# EAGLE design gen13 (EAGLE 7.2.0)
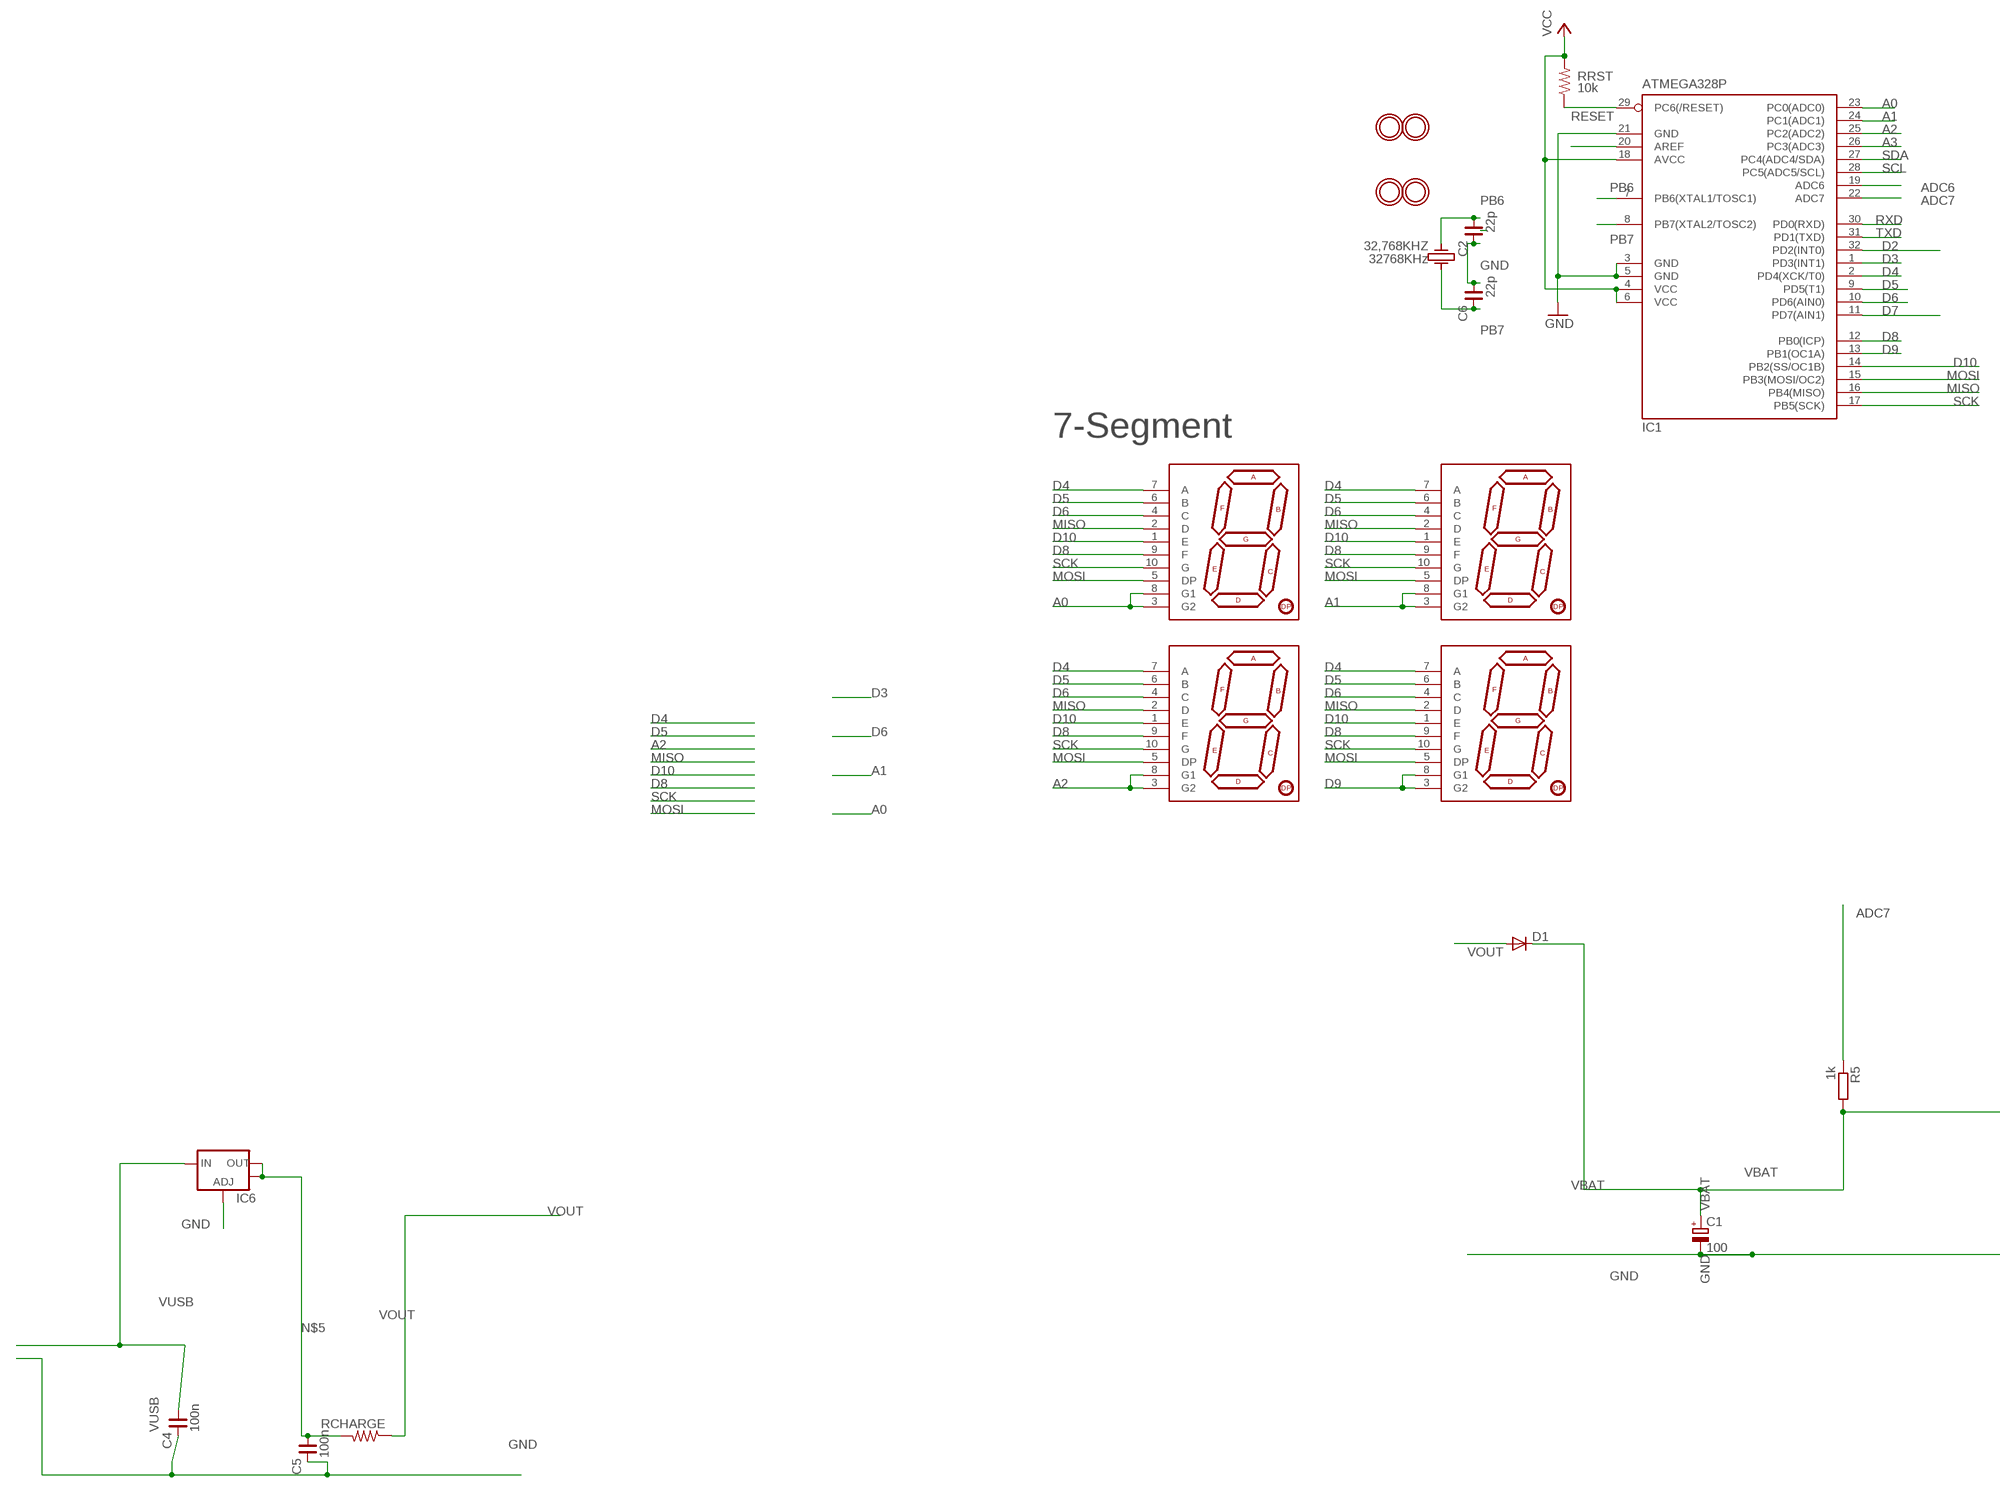
[diagram p0: schematic, sheet 1, part 1 of 2]
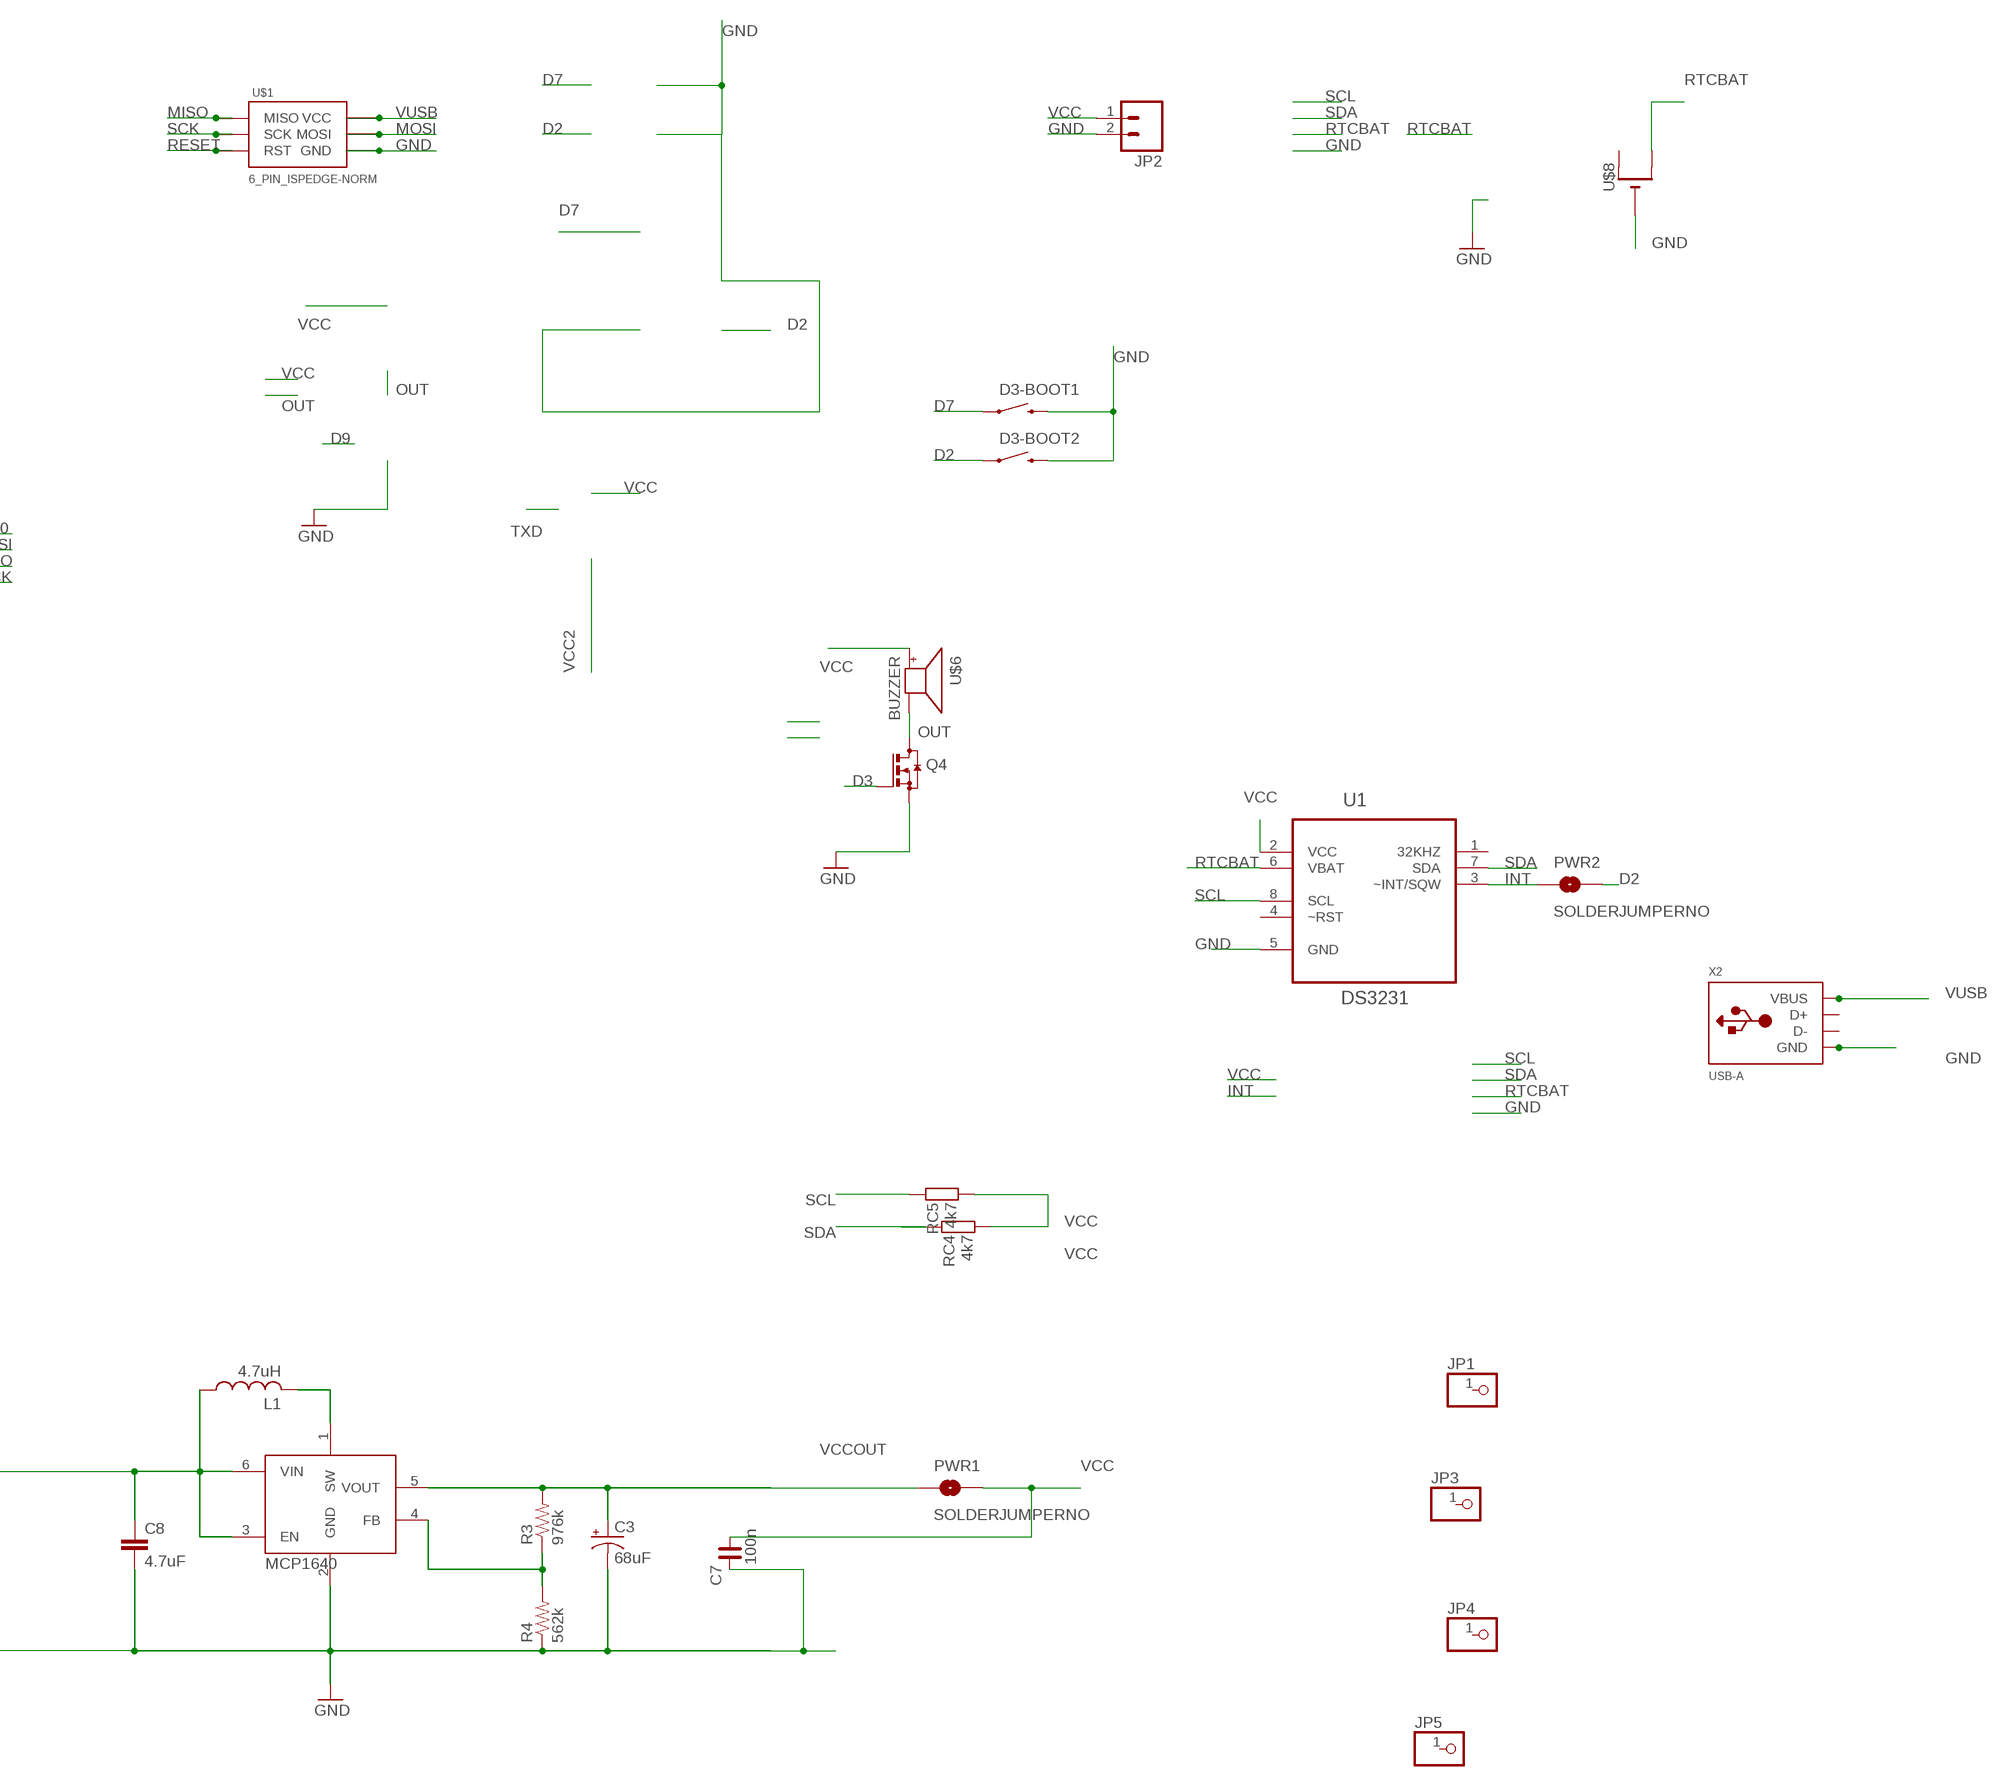
[diagram p1: schematic, sheet 1, part 2 of 2]

## Parts
32,768KHZ  32768KHz  CRYSTALL  [KX-327LT]
C1  100  CPOL-EUTT2D4  [TT2D4]
C2  22p  C_0603  [C0603]
C3  68uF  CAP_POL1206  [EIA3216]
C4  100n  C_0603  [C0603]
C5  100n  C_0603  [C0603]
C6  22p  C_0603  [C0603]
C7  100n  C_0603  [C0603]
C8  4.7uF  CAP0805  [0805]
D1  DIODE-DO214AC  [DO214AC]
D3-BOOT1  SWITCH-MOMENTARY-2-SMD-1101NE  [TACTILE-SWITCH-1101NE]
D3-BOOT2  SWITCH-MOMENTARY-2-SMD-1101NE  [TACTILE-SWITCH-1101NE]
DIG1  7-SEGMENT-DISPLAY-1"-RED  [7-SEGMENT-SMD]
DIG2  7-SEGMENT-DISPLAY-1"-RED  [7-SEGMENT-SMD]
DIG3  7-SEGMENT-DISPLAY-1"-RED  [7-SEGMENT-SMD]
DIG4  7-SEGMENT-DISPLAY-1"-RED  [7-SEGMENT-SMD]
IC1  ATMEGA328P  MEGA8-AI  [TQFP32-08]
IC6  V_REG_LM1117SOT223  [SOT223]
JP1  PINHD-1X1  [1X01]
JP2  M02PTH  [1X02]
JP3  PINHD-1X1  [1X01]
JP4  PINHD-1X1  [1X01]
JP5  PINHD-1X1  [1X01]
L1  4.7uH  LLQH44P_P0  [LQH44]
PWR1  SOLDERJUMPERNO  [SJ_2S-NO]
PWR2  SOLDERJUMPERNO  [SJ_2S-NO]
Q4  BSS123  [SOT23]
R3  976k  RESISTOR0603-RES  [0603-RES]
R4  562k  RESISTOR0603-RES  [0603-RES]
R5  1k  R-EU_R0603  [R0603]
RC4  4k7  R-EU_R0603  [R0603]
RC5  4k7  R-EU_R0603  [R0603]
RCHARGE  RESISTOR1206  [1206]
RRST  10k  R-US_R0603  [R0603@1]
U1  DS3231  DS3231MZ+  [SOIC8_150MIL]
U2  MCP1640  [SOT23-6]
U$1  6_PIN_ISPEDGE-NORM  [6_PIN_EDGE]
U$2  MOUNTINGHOLE2.0  [MOUNTINGHOLE_2.0_PLATED]
U$3  MOUNTINGHOLE2.0  [MOUNTINGHOLE_2.0_PLATED]
U$4  MOUNTINGHOLE2.0  [MOUNTINGHOLE_2.0_PLATED]
U$5  MOUNTINGHOLE2.0  [MOUNTINGHOLE_2.0_PLATED]
U$6  BUZZER  [SMT-8585-BUZZER]
U$8  CR1220SMT  [CR1220-SMD]
X2  USB-A  [MOLEX_480371000]

## Nets
A0: DIG1.3(G2) DIG1.8(G1) IC1.23(PC0(ADC0))
A1: DIG2.3(G2) DIG2.8(G1) IC1.24(PC1(ADC1))
A2: DIG3.3(G2) DIG3.8(G1) IC1.25(PC2(ADC2))
A3: IC1.26(PC3(ADC3))
ADC6: IC1.19(ADC6)
ADC7: IC1.22(ADC7) R5.1
AREF: IC1.20(AREF)
D2: D3-BOOT2.P$1 IC1.32(PD2(INT0)) PWR2.2
D3: IC1.1(PD3(INT1)) Q4.1(G)
D4: DIG1.7(A) DIG2.7(A) DIG3.7(A) DIG4.7(A) IC1.2(PD4(XCK/T0))
D5: DIG1.6(B) DIG2.6(B) DIG3.6(B) DIG4.6(B) IC1.9(PD5(T1))
D6: DIG1.4(C) DIG2.4(C) DIG3.4(C) DIG4.4(C) IC1.10(PD6(AIN0))
D7: D3-BOOT1.P$1 IC1.11(PD7(AIN1))
D8: DIG1.9(F) DIG2.9(F) DIG3.9(F) DIG4.9(F) IC1.12(PB0(ICP))
D9: DIG4.3(G2) DIG4.8(G1) IC1.13(PB1(OC1A))
D10: DIG1.1(E) DIG2.1(E) DIG3.1(E) DIG4.1(E) IC1.14(PB2(SS/OC1B))
GND [pwr]: C1.- C2.2 C3.C(-) C4.2 C5.2 C6.1 C7.2 C8.2 D3-BOOT1.P$2 D3-BOOT2.P$2 IC1.3(GND) IC1.5(GND) IC1.21(GND) IC6.1(ADJ) JP2.2 Q4.2(S) R4.1 U1.5(GND) U2.2(GND) U$1.6(GND) U$8.- X2.4(GND)
INT: PWR2.1 U1.3(~INT/SQW)
MISO: DIG1.2(D) DIG2.2(D) DIG3.2(D) DIG4.2(D) IC1.16(PB4(MISO)) U$1.1(MISO)
MOSI: DIG1.5(DP) DIG2.5(DP) DIG3.5(DP) DIG4.5(DP) IC1.15(PB3(MOSI/OC2)) U$1.4(MOSI)
N$4: L1.P$2 U2.1(SW)
N$5: C5.1 IC6.2(OUT) IC6.4(OUT) RCHARGE.2
N$6: R3.1 R4.2 U2.4(FB)
OUT: Q4.3(D) U$6.-
PB6: 32,768KHZ.4 C2.1 IC1.7(PB6(XTAL1/TOSC1))
PB7: 32,768KHZ.1 C6.2 IC1.8(PB7(XTAL2/TOSC2))
RESET: IC1.29(PC6(/RESET)) RRST.1 U$1.5(RST)
RTCBAT: U1.6(VBAT) U$8.+$2(+1)
RXD: IC1.30(PD0(RXD))
SCK: DIG1.10(G) DIG2.10(G) DIG3.10(G) DIG4.10(G) IC1.17(PB5(SCK)) U$1.3(SCK)
SCL: IC1.28(PC5(ADC5/SCL)) RC5.2 U1.8(SCL)
SDA: IC1.27(PC4(ADC4/SDA)) RC4.2 U1.7(SDA)
TXD: IC1.31(PD1(TXD))
VBAT [pwr]: C1.+ C8.1 D1.C L1.P$1 R5.2 U2.3(EN) U2.6(VIN)
VCC [vcc]: C7.1 IC1.4(VCC) IC1.6(VCC) IC1.18(AVCC) JP2.1 PWR1.2 RC4.1 RC5.1 RRST.2 U1.2(VCC) U$6.+
VCCOUT [vcc]: C3.A(+) PWR1.1 R3.2 U2.5(VOUT)
VOUT [pwr]: D1.A RCHARGE.1
VUSB: C4.1 IC6.3(IN) U$1.2(VCC) X2.1(VBUS)
Unconnected: JP1.1 JP3.1 JP4.1 JP5.1 U1.1(32KHZ) U1.4(~RST) U$8.+$1(+) X2.2(D-) X2.3(D+)

## Notes on the sheet
- 7-Segment

## Library data of the parts
32,768KHZ = es:CRYSTALL
C1 = resistor:CPOL-EU: POLARIZED CAPACITOR, European symbol
C2 C4-C7 = rc-master-smd:C_: NON-POLARIZED CAP
C3 = SparkFun:CAP_POL: Capacitor Polarized These are standard SMD and PTH capacitors. Normally 10uF, 47uF, and 100uF in electrolytic and tantalum varieties. Always verify the external diameter of the through hole cap, it varies with capacity, voltage, and manufacturer. The EIA devices should be standard.
C8 = SparkFun:CAP: Capacitor Standard 0603 ceramic capacitor, and 0.1" leaded capacitor.
D1 = diode:DIODE-: DIODE
D3-BOOT1 D3-BOOT2 = SparkFun:SWITCH-MOMENTARY-2
DIG1-DIG4 = balto:7-SEGMENT-DISPLAY-1"-RED: 7-Segment Display 1" Red (COM-08546)
IC1 = atmel:MEGA8: MICROCONTROLLER 8 Kbytes FLASH, 1 kbytes SRAM, 512 bytes EEPROM, USART, 6-channel 10 bit ADC, 2-channel 8 bit ADC Pin compatible with Atmega48, ATMega88, ATMega168 Source: avr.lbr; MPN: ATMEGA8-16AU; OC_FARNELL: 9171371; OC_NEWARK: 73M8863
IC6 = SparkFun:V_REG_LM1117: Voltage Regulator LM1117 Standard adjustable voltage regulator but in SMD form. Spark Fun Electronics SKU : COM-00595
JP1 JP3-JP5 = pinhead:PINHD-1X1: PIN HEADER
JP2 = SparkFun-Connectors:M02: Standard 2-pin 0.1" header. Use with - straight break away headers ( PRT-00116) - right angle break away headers (PRT-00553) - swiss pins (PRT-00743) - machine pins (PRT-00117) - female headers (PRT-00115) Molex polarized connector foot print use with: PRT-08233 with associated crimp pins and housings. 2.54_SCREWTERM for use with PRT-10571. 3.5mm Screw Terminal footprints for PRT-08084 5mm Screw Terminal footprints for use with PRT-08432
L1 = karlnet-parts:L
PWR1 PWR2 = SparkFun:SOLDERJUMPER: Solder Jumper Standard SMD solder jumper. Used to automate production. Two varients : Normally Open and Normally Closed are the same, but have different paste layers. NC will have a large amount of paste and should jumper during reflow.
Q4 = transistor-small-signal:BSS123: N-CHANNEL MOS FET
R3 R4 RCHARGE = SparkFun:RESISTOR: Resistor Basic schematic elements and footprints for 0603, 1206, and PTH resistors.
R5 RC4 RC5 = rcl:R-EU_: RESISTOR, European symbol
RRST = rcl:R-US_: RESISTOR, American symbol
U1 = zak:DS3231MZ+
U2 = karlnet-parts:MCP1640: MCP1623, 1624, 1640/B/C/D pwm/pfm or pwm only DC/DC converters, in SOT-23
U$1 = ppeter:6_PIN_ISP: AVR 6 PIN ISP header Edge connector normal layout
U$2-U$5 = microbuilder:MOUNTINGHOLE: Mounting Hole
U$6 = adafruit:BUZZER
U$8 = adafruit:CR1220: CR1216/CR1220/CR1225 12mm 3V lithium coin cell Great for battery packup. Both SMT and THM holders. Note the THM package has the ground pads on both sides of the PCB so that the masks are the same - this reduces the cost
X2 = adafruit:USB-A: USB type A 'plug' Used for things that can directly connect to a USB port, say USB key

## Net classes
0 default: width 0.203 mm, drill 0.356 mm, clearance 0.203 mm
1 vcc: width 0.254 mm, drill 0.356 mm, clearance 0.229 mm
2 pwr: width 0.254 mm, drill 0.356 mm, clearance 0.229 mm

## Board
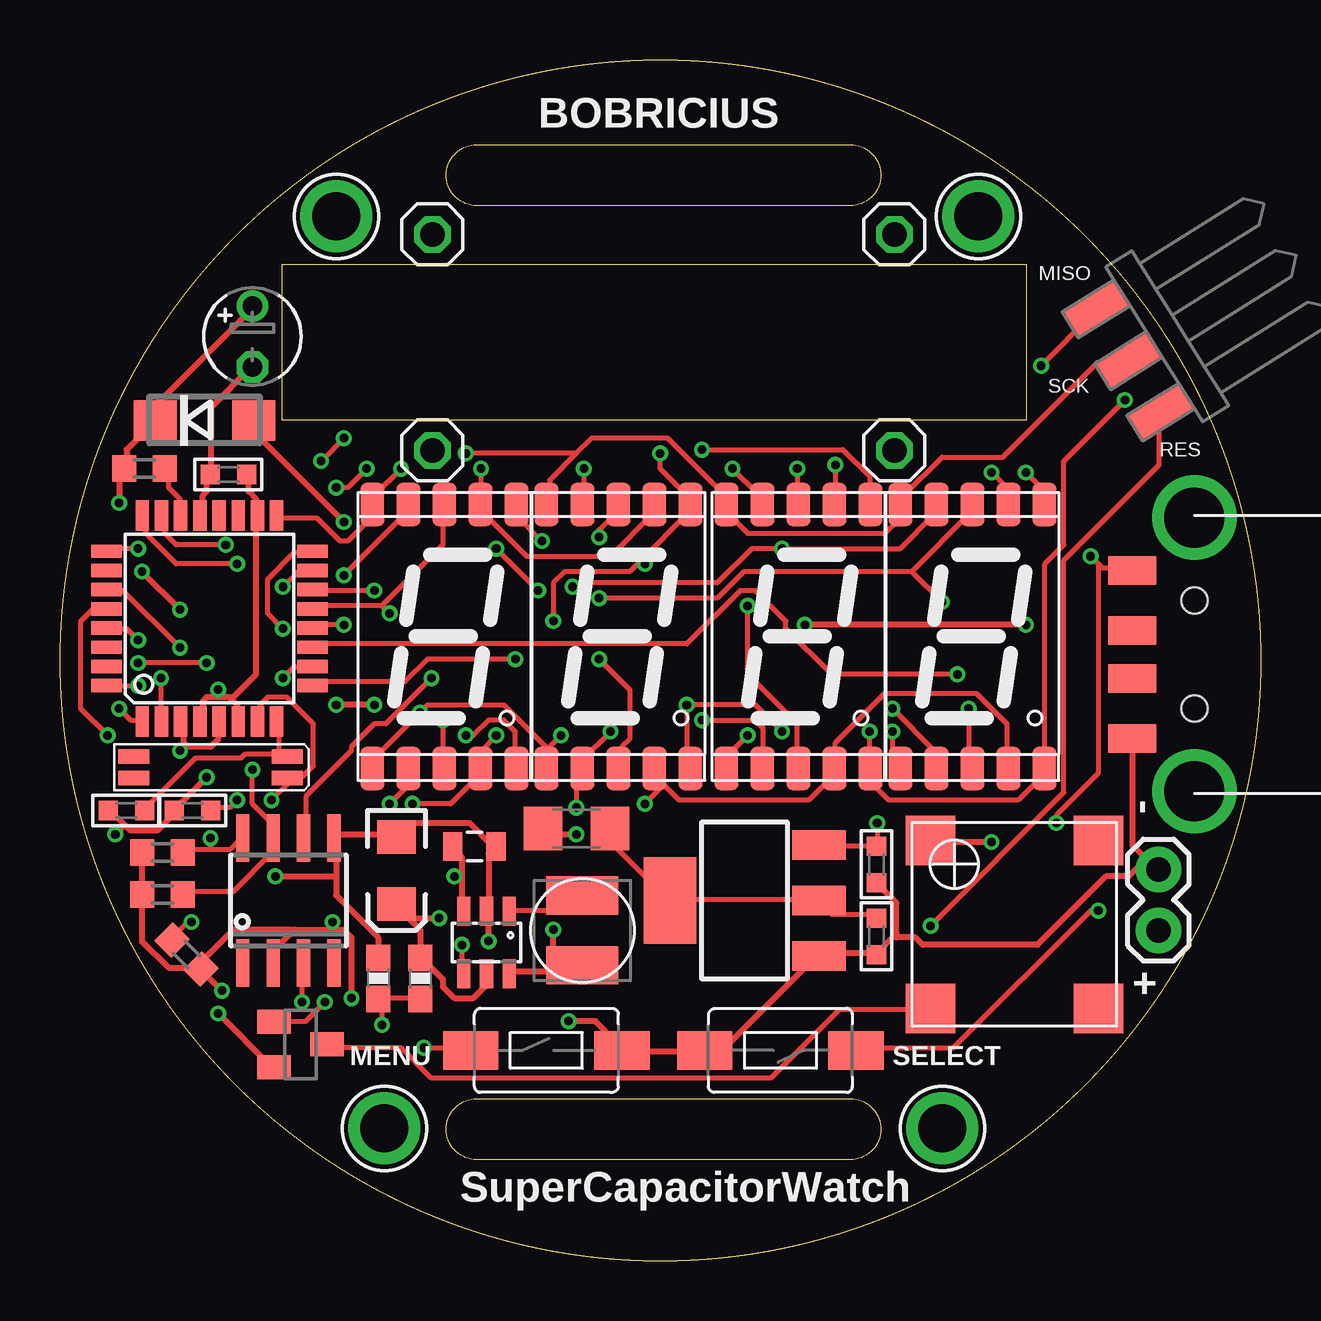
[diagram p2: board, top side]
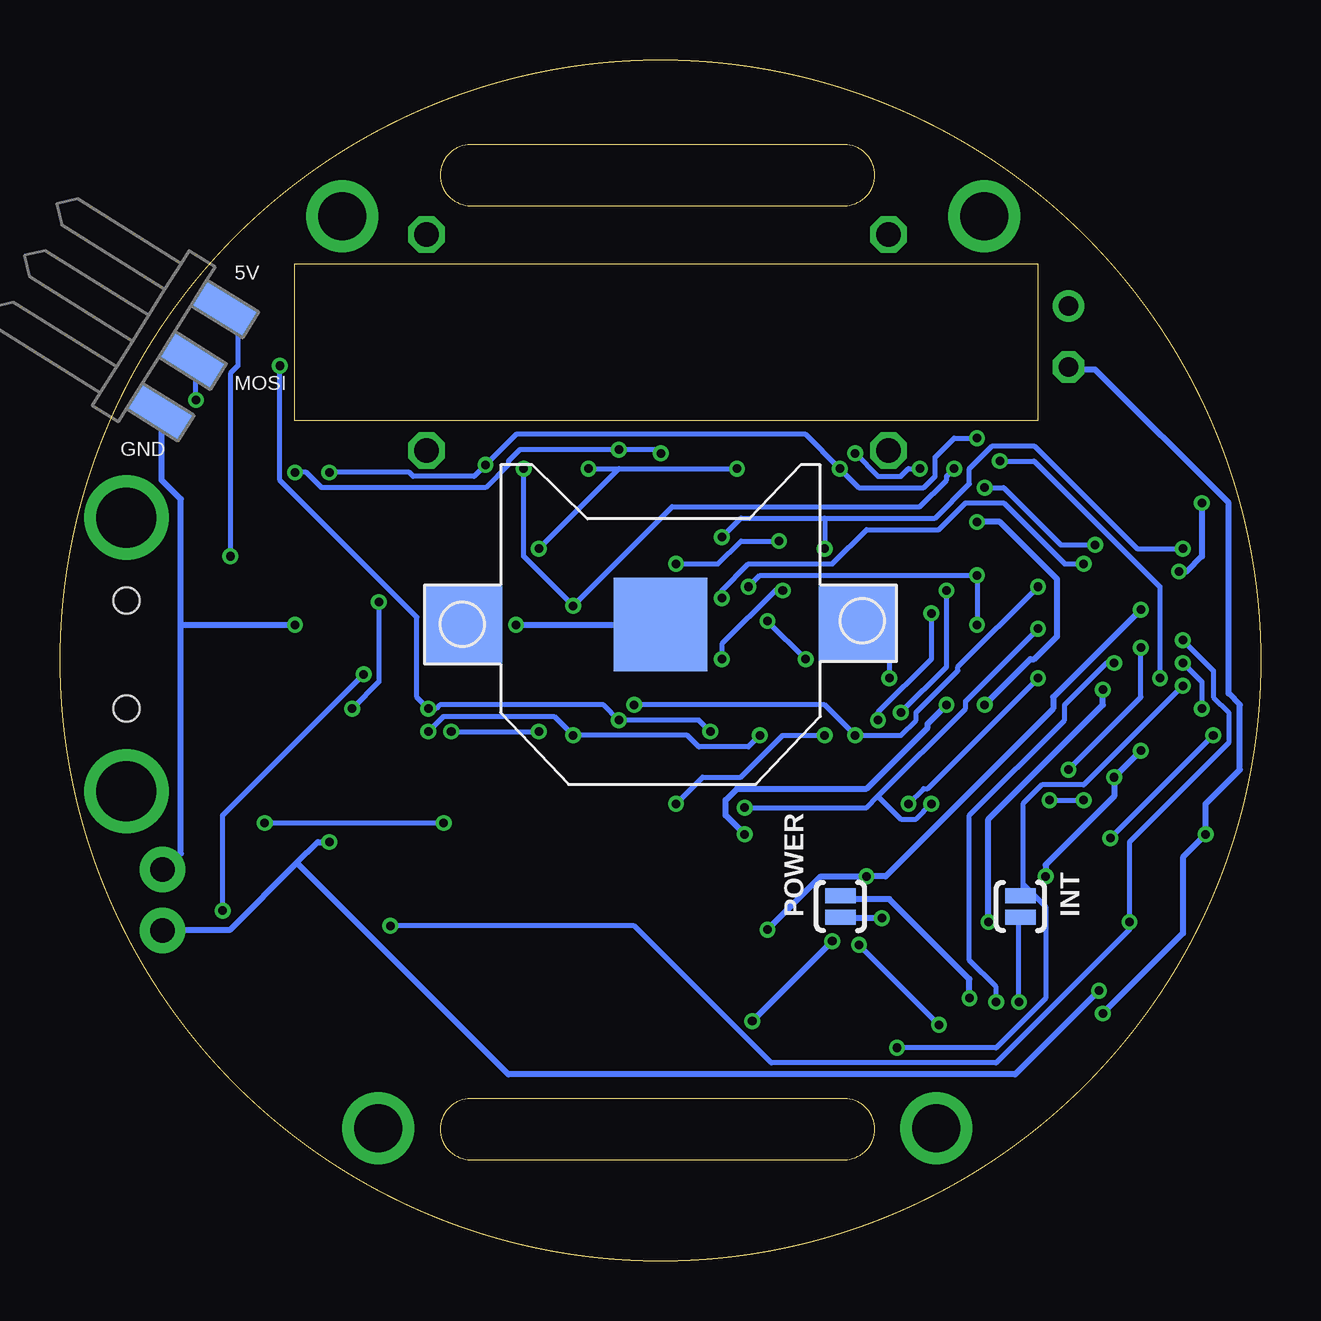
[diagram p3: board, bottom side, seen from below]

Size 50.04 x 50.04 mm. Coordinates in mm from the lower left corner, seen from the top.
Outline: 40.27,35.02 9.27,35.02 9.27,41.52 40.27,41.52 40.27,35.02
Outline: 32.93,46.51 arc-90 34.2,45.24 arc-90 32.93,43.97 17.36,43.97 arc-90 16.09,45.24 arc-90 17.36,46.51 32.93,46.51
Outline: 32.93,6.76 arc-90 34.2,5.49 arc-90 32.93,4.22 17.36,4.22 arc-90 16.09,5.49 arc-90 17.36,6.76 32.93,6.76
Outline: circle at 25.02,25.02 radius 25.02
Copper layers (1*16): Top 0.035mm / dielectric 1.5mm / Bottom 0.035mm
Design rules "ITEADstudio_DRC": minimum track width 6mil, minimum drill 12mil, track to track 6mil, track to pad 6mil, pad to pad 6mil, via to via 6mil, smd to smd 0mil, copper to edge 10mil, drill to drill 10mil, minimum pad ring 10mil, minimum via ring 6mil, stop-mask expansion 2mil, vias tented up to drill 100mil, thermal gap 10mil

### Footprints (pad centres in the part's own frame; a part is rotated, then mirrored left to right if it is on the bottom)
KX-327LT = smd 1.3 x 0.6: 1 -3.2,-0.5; 2 3.2,-0.5; 3 3.2,0.4; 4 -3.2,0.4
TT2D4 = drill 0.813: + -1.27,0 | drill 0.813 octagon: - 1.27,0
C0603 = smd 0.8 x 0.8: 1 -0.762,0; 2 0.762,0
EIA3216 = smd 1.4 x 1.6: A 1.4,0; C -1.4,0
0805 = smd 0.8 x 1.2: 1 -0.9,0; 2 0.9,0
DO214AC = smd 1.8 x 1.7: A 2.05,0; C -2.05,0
TACTILE-SWITCH-1101NE = smd 2.3 x 1.6: P$1 -3.15,0; P$2 3.15,0
7-SEGMENT-SMD = smd 1 x 1.8: 1 -3,-5.5; 2 -1.5,-5.5; 3 0,-5.5; 4 1.5,-5.5; 5 3,-5.5; 6 3,5.5; 7 1.5,5.5; 8 0,5.5; 9 -1.5,5.5; 10 -3,5.5
TQFP32-08 = smd 1.27 x 0.559: 1 -4.293,2.8; 2 -4.293,2; 3 -4.293,1.2; 4 -4.293,0.4; 5 -4.293,-0.4; 6 -4.293,-1.2; 7 -4.293,-2; 8 -4.293,-2.8; 17 4.293,-2.8; 18 4.293,-2; 19 4.293,-1.2; 20 4.293,-0.4; 21 4.293,0.4; 22 4.293,1.2; 23 4.293,2; 24 4.293,2.8 | smd 0.559 x 1.27: 9 -2.8,-4.293; 10 -2,-4.293; 11 -1.2,-4.293; 12 -0.4,-4.293; 13 0.4,-4.293; 14 1.2,-4.293; 15 2,-4.293; 16 2.8,-4.293; 25 2.8,4.293; 26 2,4.293; 27 1.2,4.293; 28 0.4,4.293; 29 -0.4,4.293; 30 -1.2,4.293; 31 -2,4.293; 32 -2.8,4.293
SOT223 = smd 1.219 x 2.235: 1 -2.311,-3.099; 2 0,-3.099; 3 2.311,-3.099 | smd 3.6 x 2.2: 4 0,3.099
1X01 = drill 1.016 octagon: 1 0,0
1X02 = drill 1.016 pad 1.88: 1 0,0; 2 2.54,0
LQH44 = smd 1.6 x 3: P$1 -1.45,0; P$2 1.45,0
SJ_2S-NO = smd 0.635 x 1.27: 1 -0.45,0; 2 0.45,0
SOT23 = smd 1 x 1.4: 1 -0.95,-1.1; 2 0.95,-1.1; 3 0,1.1
0603-RES = smd 1.1 x 1: 1 -0.85,0; 2 0.85,0
R0603 = smd 1 x 1.1: 1 -0.85,0; 2 0.85,0
1206 = smd 1.6 x 1.8: 1 -1.4,0; 2 1.4,0
R0603@1 = smd 1 x 1.1: 1 -0.85,0; 2 0.85,0
SOIC8_150MIL = smd 0.559 x 1.981: 1 -1.905,-2.6; 2 -0.635,-2.6; 3 0.635,-2.6; 4 1.905,-2.6; 5 1.905,2.6; 6 0.635,2.6; 7 -0.635,2.6; 8 -1.905,2.6
SOT23-6 = smd 0.55 x 1.2: 1 -0.95,-1.3; 2 0,-1.3; 3 0.95,-1.3; 4 0.95,1.3; 5 0,1.3; 6 -0.95,1.3
6_PIN_EDGE = smd 1.27 x 2.54: 1 2.54,0; 3 0,0; 5 -2.54,0 | smd 1.27 x 2.54 bottom: 2 2.54,0; 4 0,0; 6 -2.54,0
MOUNTINGHOLE_2.0_PLATED = drill 2 pad 3: P$1 0,0
SMT-8585-BUZZER = smd 2.05 x 2.05: + -3.5,-3.5; - 3.5,-3.5; NC1 -3.5,3.5; NC2 3.5,3.5
CR1220-SMD = smd 3.2 x 3.2: +$1 -8.2,0; +$2 8.2,0 | smd 3.9 x 3.9: - 0,0
MOLEX_480371000 = smd 1.2 x 2: 1 3.5,2.6; 2 1,2.6; 3 -1,2.6; 4 -3.5,2.6 | drill 2.5: M1 -5.7,0; M2 5.7,0 | hole 1.1: -2.25,0; 2.25,0

### Placement (x,y rotation side)
32,768KHZ  6.27,20.52 180 top
C1  8.02,38.52 270 top
C2  5.52,18.77 180 top
C3  14.02,16.27 270 top
C4  34.02,16.52 270 top
C5  34.02,13.52 270 top
C6  2.77,18.77 0 top
C7  7.02,32.77 180 top
C8  17.27,17.27 0 top
D1  6.02,35.02 0 top
D3-BOOT1  30.02,8.77 180 top
D3-BOOT2  20.27,8.77 0 top
DIG1  30.77,26.02 0 top
DIG2  38.02,26.02 0 top
DIG3  23.27,26.02 0 top
DIG4  16.02,26.02 0 top
IC1  6.23,26.77 90 top
IC6  28.52,15.02 90 top
JP1  15.52,42.77 0 top
JP2  45.77,13.77 90 top
JP3  15.52,33.77 0 top
JP4  34.77,42.77 0 top
JP5  34.77,33.77 0 top
L1  21.77,13.77 90 top
PWR1  17.52,14.77 90 bottom
PWR2  10.02,14.77 90 bottom
Q4  10.02,9.02 270 top
R3  15.02,11.77 90 top
R4  13.27,11.77 270 top
R5  3.52,33.02 180 top
RC4  4.27,15.27 0 top
RC5  4.27,17.02 0 top
RCHARGE  21.52,18.02 0 top
RRST  5.27,12.77 315 top
U1  9.52,15.02 0 top
U2  17.77,13.27 180 top
U$1  44.52,37.52 122 top
U$2  11.52,43.52 0 top
U$3  36.77,5.52 0 top
U$4  13.52,5.52 0 top
U$5  38.27,43.52 0 top
U$6  39.77,14.02 270 top
U$8  25.02,26.52 0 bottom
X2  47.27,25.27 90 top

### Tracks (layer width: path | path; a pad name or v marks a point on that pad's centre or on a via)
A0  (via drill 0.36)
  Top 0.203: v6.91,29.84 4.84,29.84 4.37,30.31 4.37,30.95 IC1.23 | v11.51,32.22 11.99,32.22 v12.78,33.01 | v28.65,27.3 28.65,24.44 30.72,22.38 30.72,20.63 DIG1.3 | v30.72,33.01 30.72,31.58 DIG1.8
  Bottom 0.203: v6.91,29.84 8.34,29.84 10.72,32.22 v11.51,32.22 | v12.78,33.01 13.1,32.69 13.1,32.53 14.21,31.42 24.53,31.42 v28.65,27.3 30.72,29.36 v30.72,33.01
A1  (via drill 0.36)
  Top 0.203: v7.38,29.04 4.84,29.04 3.57,30.31 3.57,30.95 IC1.24 | v22.46,27.61 27.38,27.61 28.5,28.72 35.48,28.72 | 35.48,28.72 37.86,31.11 37.86,31.42 DIG2.8 | v37.86,23.01 37.86,20.63 DIG2.3 | 35.48,28.72 v36.75,27.45
  Bottom 0.203: v7.38,29.04 8.18,29.04 10.72,31.58 12.3,31.58 13.41,30.47 16.43,30.47 17.86,29.04 21.35,29.04 22.46,27.93 v22.46,27.61 | v37.86,23.01 36.75,24.12 v36.75,27.45
A2  (via drill 0.36)
  Top 0.203: v3.25,29.68 1.98,29.68 IC1.25 | v22.46,30.15 22.46,30.47 23.42,31.42 DIG3.8 | v22.46,25.07 23.73,23.8 23.73,21.74 23.42,21.42 23.42,20.63 DIG3.3 | v18.18,29.68 v19.92,27.93
  Bottom 0.203: v3.25,29.68 5.16,29.68 9.45,33.96 11.19,33.96 12.14,33.01 12.14,32.38 13.57,30.95 18.18,30.95 | 18.18,30.95 21.67,30.95 v22.46,30.15 | v22.46,25.07 22.46,25.71 20.24,27.93 v19.92,27.93 | 18.18,30.95 v18.18,29.68
ADC7
  Top 0.203: R5.1 4.52,33.01 4.52,32.22 5,31.74 5,31.11 IC1.22
D2  (via drill 0.36)
  Top 0.203: v3.25,23.96 1.98,23.96 IC1.32 | v15.16,8.88 17.07,8.88 D3-BOOT2.P$1
  Bottom 0.203: 9.92,15.71 9.92,19.04 9.13,19.83 7.38,19.83 v3.25,23.96 | 9.92,15.71 9.92,15.23 PWR2.2 | v15.16,8.88 11.03,8.88 8.97,10.94 8.97,14.75 9.92,15.71
D3  (via drill 0.36)
  Top 0.203: v2.46,23.01 2.94,22.53 3.41,22.53 IC1.1 | v6.11,24.91 v3.25,24.91 | v11.03,10.79 10.24,9.99 8.97,9.99 Q4.1
  Bottom 0.203: v2.46,23.01 2.46,24.12 v3.25,24.91 | v6.11,24.91 6.43,24.91 8.18,23.17 8.18,22.53 12.14,18.56 12.14,12.53 11.03,11.42 v11.03,10.79
D4  (via drill 0.36)
  Top 0.203: v4.21,24.28 4.21,22.53 IC1.2 | v11.83,34.28 v10.88,33.33 | v17.54,33.01 17.54,31.58 DIG4.7 17.38,31.42 19.45,29.36 22.94,29.36 24.69,31.11 24.69,31.42 DIG3.7 | v32.31,33.17 32.31,31.58 DIG1.7 | v38.81,32.85 39.45,32.22 39.45,31.58 DIG2.7
  Bottom 0.203: v4.21,24.28 4.21,28.09 9.45,33.33 v10.88,33.33 | v11.83,34.28 12.78,34.28 13.57,33.49 13.57,32.69 14.05,32.22 16.75,32.22 v17.54,33.01 18.97,34.44 31.04,34.44 v32.31,33.17 32.78,32.69 35.32,32.69 35.48,32.85 v38.81,32.85
D5  (via drill 0.36)
  Top 0.203: v18.97,25.07 15.32,25.07 14.37,24.12 10.56,24.12 IC1.9 | v20.56,26.66 20.56,28.25 21.03,28.72 23.73,28.72 24.21,29.2 | 24.21,29.2 26.11,31.11 26.11,31.42 DIG3.6 26.11,31.58 26.11,31.9 25,33.01 v25,33.65 | v20.08,29.99 19.13,30.95 19.13,31.42 DIG4.6 | 24.21,29.2 v24.37,29.04 | v26.75,33.8 32.62,33.8 33.73,32.69 33.73,31.58 DIG1.6 | v40.24,32.85 40.88,32.22 40.88,31.58 DIG2.6
  Bottom 0.203: v20.56,26.66 v18.97,25.07 | v20.08,29.99 21.67,29.99 22.62,29.04 v24.37,29.04 | v25,33.65 25.16,33.8 v26.75,33.8 30.88,33.8 31.35,33.33 31.35,33.17 32.31,32.22 39.13,32.22 39.77,32.85 v40.24,32.85
D6  (via drill 0.36)
  Top 0.203: v9.29,24.28 9.76,24.76 10.4,24.76 IC1.10 | v14.68,19.04 16.27,19.04 17.38,20.15 17.38,20.47 DIG4.4 17.54,20.63 17.54,21.26 v18.18,21.9 | 25.16,19.83 25.8,19.2 31.19,19.2 32.15,20.15 32.15,20.47 DIG1.4 32.31,20.63 32.31,21.58 34.37,23.64 38.18,23.64 39.45,22.38 39.45,20.63 DIG2.4 | 25.16,19.83 24.84,20.15 24.84,20.47 DIG3.4 25.16,19.83 | 25.16,19.83 v24.37,19.04
  Bottom 0.203: v9.29,24.28 13.89,19.68 14.05,19.68 v14.68,19.04 | v18.18,21.9 19.92,21.9 21.67,20.15 23.26,20.15 v24.37,19.04
D7  (via drill 0.36)
  Top 0.203: v37.39,24.44 32.15,24.44 30.24,26.34 30.24,26.66 28.97,27.93 28.34,27.93 26.11,25.71 10.56,25.71 IC1.11 | v43.26,14.6 42.94,14.6 37.23,8.88 33.26,8.88 D3-BOOT1.P$1
  Bottom 0.203: v37.39,24.44 43.26,18.56 v43.26,14.6
D8  (via drill 0.36)
  Top 0.203: v11.83,26.5 10.56,26.5 IC1.12 | v11.83,28.57 14.37,31.11 14.37,31.42 DIG4.9 | v21.83,33.01 21.83,31.58 DIG3.9 | v28.02,33.01 29.13,31.9 29.13,31.58 DIG1.9 | DIG2.9 36.43,31.42 36.43,31.11 35,29.68 v30.08,29.68 28.81,29.68 27.38,28.25 22.15,28.25 21.99,28.09 v21.35,28.09
  Bottom 0.203: v11.83,26.5 v11.83,28.57 20.88,28.57 v21.35,28.09 | v28.02,33.01 26.75,33.01 | 26.75,33.01 v21.83,33.01 | 26.75,33.01 v30.08,29.68
D9  (via drill 0.36)
  Top 0.203: 13.41,27.3 10.56,27.3 IC1.13 | 13.41,27.3 15.95,29.84 15.95,31.42 DIG4.8 | v15.95,22.53 15.95,20.63 DIG4.3 | 13.41,27.3 v13.73,26.98
  Bottom 0.203: v15.95,22.53 15.95,22.85 13.73,25.07 v13.73,26.98
D10  (via drill 0.36)
  Top 0.203: v28.65,21.9 27.86,21.1 27.86,20.63 DIG1.1 | v34.69,22.06 34.69,20.95 35,20.63 DIG2.1 | v13.1,27.93 10.56,27.93 IC1.14 | DIG4.1 13.1,20.63 13.1,20.95 v15,22.85 15.32,23.17 18.49,23.17 20.24,21.42 20.24,21.26 | 20.24,21.26 20.24,20.63 DIG3.1 20.24,21.26 | 20.24,21.26 v20.88,21.9
  Bottom 0.203: v34.69,22.06 34.05,22.69 29.45,22.69 v28.65,21.9 23.89,21.9 23.42,21.42 21.35,21.42 v20.88,21.9 | v13.1,27.93 13.1,24.76 v15,22.85
GND  (via drill 0.36)
  Top 0.254: 11.51,16.02 11.51,17.61 U1.5 11.51,17.77 13.89,17.77 C3.C 14.05,17.77 14.53,18.25 17.07,18.25 18.02,17.29 C8.2 18.02,17.14 17.86,16.98 17.86,14.6 U2.2 17.86,14.44 v17.86,13.33 | 11.51,16.02 11.51,15.23 13.26,13.48 13.26,12.69 R4.1 | 5.8,31.11 IC1.21 5.95,31.11 5.95,31.9 6.11,32.06 6.11,32.69 C7.2 6.27,32.85 6.27,35.55 8.02,37.3 C1.- | 5,22.53 IC1.3 5.16,22.38 5.16,21.58 5.24,21.5 | 5.24,21.5 5.32,21.42 6.27,21.42 6.59,21.74 6.59,22.38 IC1.5 6.59,22.53 | 2.7,18.17 2.94,17.93 4.05,17.93 4.84,18.72 C2.2 4.84,18.88 v6.11,20.15 | 2.7,18.17 2.14,18.72 C6.1 | v6.59,10.31 8.81,8.09 Q4.2 | 2.7,18.17 v2.3,17.77 | v5,21.26 5.24,21.5 | v8.97,16.02 11.51,16.02 | 34.77,13.56 34.05,12.85 C5.2 33.89,12.85 31.67,12.85 IC6.1 31.51,12.69 27.7,8.88 26.91,8.88 D3-BOOT1.P$2 26.75,8.72 23.57,8.72 D3-BOOT2.P$2 23.42,8.88 22.3,9.99 v21.19,9.99 | 34.77,13.56 34.85,13.64 34.85,14.91 34.05,15.71 C4.2 | X2.4 44.69,21.74 44.69,17.29 45.64,16.34 JP2.2 45.16,16.66 44.53,16.02 43.58,16.02 40.72,13.17 35.96,13.17 35.64,13.48 34.85,13.48 34.77,13.56 | v40.24,26.5 v31.04,26.5
  Bottom 0.254: v6.59,10.31 3.25,13.64 3.25,16.82 v2.3,17.77 2.3,19.04 0.87,20.47 0.87,23.17 1.35,23.64 1.35,31.58 6.91,37.14 8.02,37.14 C1.- | v5,21.26 v6.11,20.15 6.11,19.36 8.97,16.5 v8.97,16.02 | 45.96,35.39 U$1.6 45.8,35.23 45.8,32.53 45.01,31.74 45.01,26.5 | 45.01,26.5 45.01,16.98 45.64,16.34 JP2.2 | v31.04,26.5 25.16,26.5 U$8.- | 45.01,26.5 v40.24,26.5 | v21.19,9.99 v17.86,13.33
INT  (via drill 0.36)
  Top 0.203: v10.08,10.79 10.08,12.37 U1.3
  Bottom 0.203: v10.08,10.79 10.08,14.28 PWR2.1
MISO  (via drill 0.36)
  Top 0.203: v9.29,26.34 8.65,26.98 8.65,28.41 9.76,29.52 10.4,29.52 IC1.16 | v21.51,18.88 21.51,20.31 21.67,20.47 DIG3.2 21.83,20.63 21.83,20.95 v22.94,22.06 | v13.73,19.04 14.37,19.68 14.37,20.47 DIG4.2 | v26.75,22.53 28.97,22.53 29.29,22.22 29.29,20.63 DIG1.2 | v34.69,23.01 36.43,21.26 36.43,20.63 DIG2.2 | v40.88,37.3 43.1,39.52 U$1.1
  Bottom 0.203: v9.29,26.34 12.3,23.33 12.3,23.01 15.95,19.36 | 15.95,19.36 16.43,18.88 v21.51,18.88 | v13.73,19.04 14.37,18.41 15,18.41 15.95,19.36 | v22.94,22.06 23.42,22.53 v26.75,22.53 27.38,23.17 34.21,23.17 34.37,23.01 v34.69,23.01 35.16,23.49 35.16,26.82 40.88,32.53 v40.88,37.3
MOSI  (via drill 0.36)
  Top 0.203: v9.29,28.09 9.92,28.72 10.4,28.72 IC1.15 | v16.91,21.9 17.23,21.9 17.86,22.53 18.49,22.53 18.97,22.06 18.97,20.63 DIG4.5 | DIG3.5 26.11,20.63 v26.11,23.17 28.97,23.17 v30.08,22.06 | v44.37,35.87 41.83,33.33 41.83,29.84 41.04,29.04 41.04,20.63 DIG2.5 40.88,20.47 40.88,20.15 39.93,19.2 34.53,19.2 33.89,19.83 33.89,20.47 DIG1.5 33.73,20.63 v33.73,22.06
  Bottom 0.203: v9.29,28.09 12.62,24.76 12.62,24.6 14.37,22.85 14.37,22.53 15,21.9 v16.91,21.9 18.18,23.17 v26.11,23.17 | v44.37,35.87 44.37,37.46 U$1.4 | v33.73,22.06 v30.08,22.06
N$4
  Top 0.203: U2.1 18.81,14.6 21.19,14.6 21.67,15.07 L1.P$2
N$5
  Top 0.203: C5.1 33.89,14.44 32.15,14.44 31.67,14.91 IC6.2 31.51,15.07 25.48,15.07 IC6.4 25.32,15.07 22.94,17.45 22.94,17.93 RCHARGE.2
N$6  (via drill 0.36)
  Top 0.203: R3.1 15,10.94 13.41,10.94 R4.2 13.41,10.79 v13.41,9.83 | v16.75,13.17 16.75,12.06 U2.4
  Bottom 0.203: v13.41,9.83 v16.75,13.17
OUT
  Top 0.203: Q4.3 11.19,8.88 14.21,8.88 15.48,7.61 29.61,7.61 32.47,10.47 36.12,10.47 U$6.-
PB6  (via drill 0.36)
  Top 0.203: v7.38,19.2 7.06,18.88 6.43,18.88 C2.1 | v8.81,19.2 9.6,19.99 32,768KHZ.4 9.6,20.15 10.08,20.15 10.56,20.63 10.56,22.38 9.45,23.49 8.65,23.49 8.34,23.17 8.34,22.53 IC1.7
  Bottom 0.203: v8.81,19.2 v7.38,19.2
PB7
  Top 0.203: 9.13,21.1 9.45,21.1 32,768KHZ.1 9.13,21.1 | 9.13,21.1 7.7,21.1 7.54,20.95 5.64,20.95 3.57,18.88 C6.2 | 9.13,21.1 9.13,22.38 IC1.8
RESET  (via drill 0.36)
  Top 0.203: v5.48,14.12 5.32,14.12 4.68,13.48 RRST.1 | v3.25,25.87 2.78,26.34 1.98,26.34 IC1.29 | v36.27,13.96 41.83,19.52 41.83,29.2 45.8,33.17 45.8,35.23 U$1.5
  Bottom 0.203: v3.25,25.87 1.98,24.6 1.98,23.49 1.35,22.85 1.35,21.58 5.48,17.45 v5.48,14.12 5.48,13.8 11.03,8.25 20.4,8.25 26.11,13.96 v36.27,13.96
RTCBAT  (via drill 0.36)
  Top 0.203: v15.48,24.28 13.57,22.38 13.1,22.38 12.14,21.42 12.14,21.26 10.24,19.36 10.24,17.77 U1.6
  Bottom 0.203: v15.48,24.28 15.48,25.23 16.75,26.5 U$8.+$2
SCK  (via drill 0.36)
  Top 0.203: IC1.17 9.13,30.95 10.72,30.95 11.67,29.99 11.99,29.99 12.94,30.95 12.94,31.42 DIG4.10 13.1,31.58 13.1,31.9 v14.21,33.01 | 21.51,33.65 22.15,34.28 25.32,34.28 27.7,31.9 27.7,31.58 DIG1.10 27.86,31.42 27.86,31.11 28.65,30.31 34.37,30.31 35,30.95 35,31.42 DIG2.10 35.16,31.58 35.16,31.9 36.75,33.49 39.29,33.49 43.26,37.46 44.37,37.46 U$1.3 | 21.51,33.65 20.4,32.53 20.4,31.58 DIG3.10 | 21.51,33.65 v16.91,33.65
  Bottom 0.203: v14.21,33.01 14.68,33.01 15,32.69 15.95,32.69 v16.91,33.65
SCL  (via drill 0.36)
  Top 0.203: 6.27,17.14 7.06,17.14 7.54,17.61 U1.8 | 6.27,17.14 5.16,17.14 RC5.2 | v1.98,21.9 0.87,23.01 0.87,26.66 1.35,27.14 1.83,27.14 IC1.28 | 6.27,17.14 v6.27,17.61
  Bottom 0.203: v6.27,17.61 v1.98,21.9
SDA  (via drill 0.36)
  Top 0.203: RC4.2 5.16,15.39 7.22,15.39 8.81,16.98 8.81,17.61 U1.7 8.81,17.77 8.81,18.25 8.02,19.04 v8.02,20.47 | v5,25.55 2.62,27.93 1.98,27.93 IC1.27
  Bottom 0.203: v5,25.55 5,23.49 v8.02,20.47
VBAT  (via drill 0.36)
  Top 0.254: 16.75,16.02 16.75,16.82 16.43,17.14 C8.1 | 16.75,16.02 16.75,14.6 U2.3 | 20.56,12.06 21.51,12.06 21.67,12.21 L1.P$1 20.56,12.06 | 20.56,12.06 18.81,12.06 U2.6 | v16.43,16.02 16.75,16.02 | 20.56,12.06 v20.56,13.8 | C1.+ 8.02,39.68 4.05,35.71 4.05,35.07 D1.C 3.89,34.92 2.78,33.8 2.78,33.17 R5.2 2.62,33.01 2.46,32.85 v2.46,31.58 | v3.41,28.72 v5,27.14
  Bottom 0.254: v20.56,13.8 18.34,16.02 v16.43,16.02 15.64,16.02 8.65,23.01 8.65,23.49 v5,27.14 | v3.41,28.72 3.1,28.72 2.46,29.36 v2.46,31.58
VCC  (via drill 0.36)
  Top 0.254: v38.81,17.45 36.27,17.45 U$6.+ | C7.1 7.86,32.69 7.86,32.06 8.18,31.74 8.18,31.11 IC1.18 8.18,30.95 8.18,24.44 7.14,23.41 | 5.8,22.53 IC1.4 5.95,22.53 5.95,23.33 6.11,23.49 6.59,23.49 | 6.59,23.49 7.06,23.49 7.14,23.41 | 7.14,23.41 7.38,23.17 7.38,22.53 IC1.6 7.54,22.53 | RC5.1 3.41,16.98 3.41,15.39 RC4.1 3.41,15.23 3.41,13.33 4.52,12.21 5.8,12.21 RRST.2 | v12.14,10.94 12.14,13.48 11.83,13.8 11.35,13.8 | 11.35,13.8 9.76,13.8 9.68,13.72 | 9.68,13.72 8.97,13.01 8.97,12.53 U1.2 | RRST.2 5.95,12.21 5.95,12.53 7.22,13.8 9.6,13.8 9.68,13.72 | v6.59,23.8 6.59,23.49 | 11.35,13.8 v11.35,14.12 | v6.75,11.26 5.95,12.06 RRST.2
  Bottom 0.254: v38.81,17.45 39.29,17.45 40.16,16.58 | 40.16,16.58 42.94,13.8 45.64,13.8 JP2.1 | v12.14,10.94 12.14,11.74 15.48,15.07 17.38,15.07 PWR1.2 | v6.59,23.8 6.59,23.17 11.35,18.41 v11.35,14.12 | 40.16,16.58 31.35,7.77 10.24,7.77 v6.75,11.26
VCCOUT  (via drill 0.36)
  Top 0.254: U2.5 17.7,11.9 17.7,11.42 17.23,10.94 16.43,10.94 15.95,11.42 15.95,11.74 15.16,12.53 R3.2 15,12.69 15,13.8 14.05,14.75 C3.A 14.68,14.28 v15.8,14.28
  Bottom 0.254: v15.8,14.28 17.38,14.28 PWR1.1
VOUT  (via drill 0.36)
  Top 0.254: v11.83,30.79 8.18,34.44 8.18,34.92 D1.A | v13.1,23.17 v11.51,23.17 | v21.51,17.77 20.4,17.77 20.24,17.93 RCHARGE.1
  Bottom 0.254: v11.83,30.79 10.88,30.79 8.49,28.41 8.49,26.03 9.45,25.07 9.6,25.07 v11.51,23.17 | v13.1,23.17 13.89,22.38 13.89,22.22 16.43,19.68 21.83,19.68 22.3,19.2 22.3,18.56 v21.51,17.77
VUSB  (via drill 0.36)
  Top 0.203: IC6.3 31.67,17.29 33.89,17.29 C4.1 34.05,17.29 v34.05,18.25 | v42.94,29.36 43.26,29.04 | 43.26,29.04 43.42,28.88 44.53,28.88 X2.1 | v41.51,18.25 41.51,18.56 43.26,20.31 43.26,29.04
  Bottom 0.203: v42.94,29.36 42.94,36.98 42.62,37.3 42.62,39.04 43.1,39.52 U$1.2 | v41.51,18.25 v34.05,18.25

### Text on the board
tNames: BOBRICIUS | MISO | SCK | RES | - | + | MENU | SELECT | SuperCapacitorWatch
bNames: 5V | MOSI | GND | INT | POWER